# EAGLE design bp_usb (EAGLE 9.5.0)
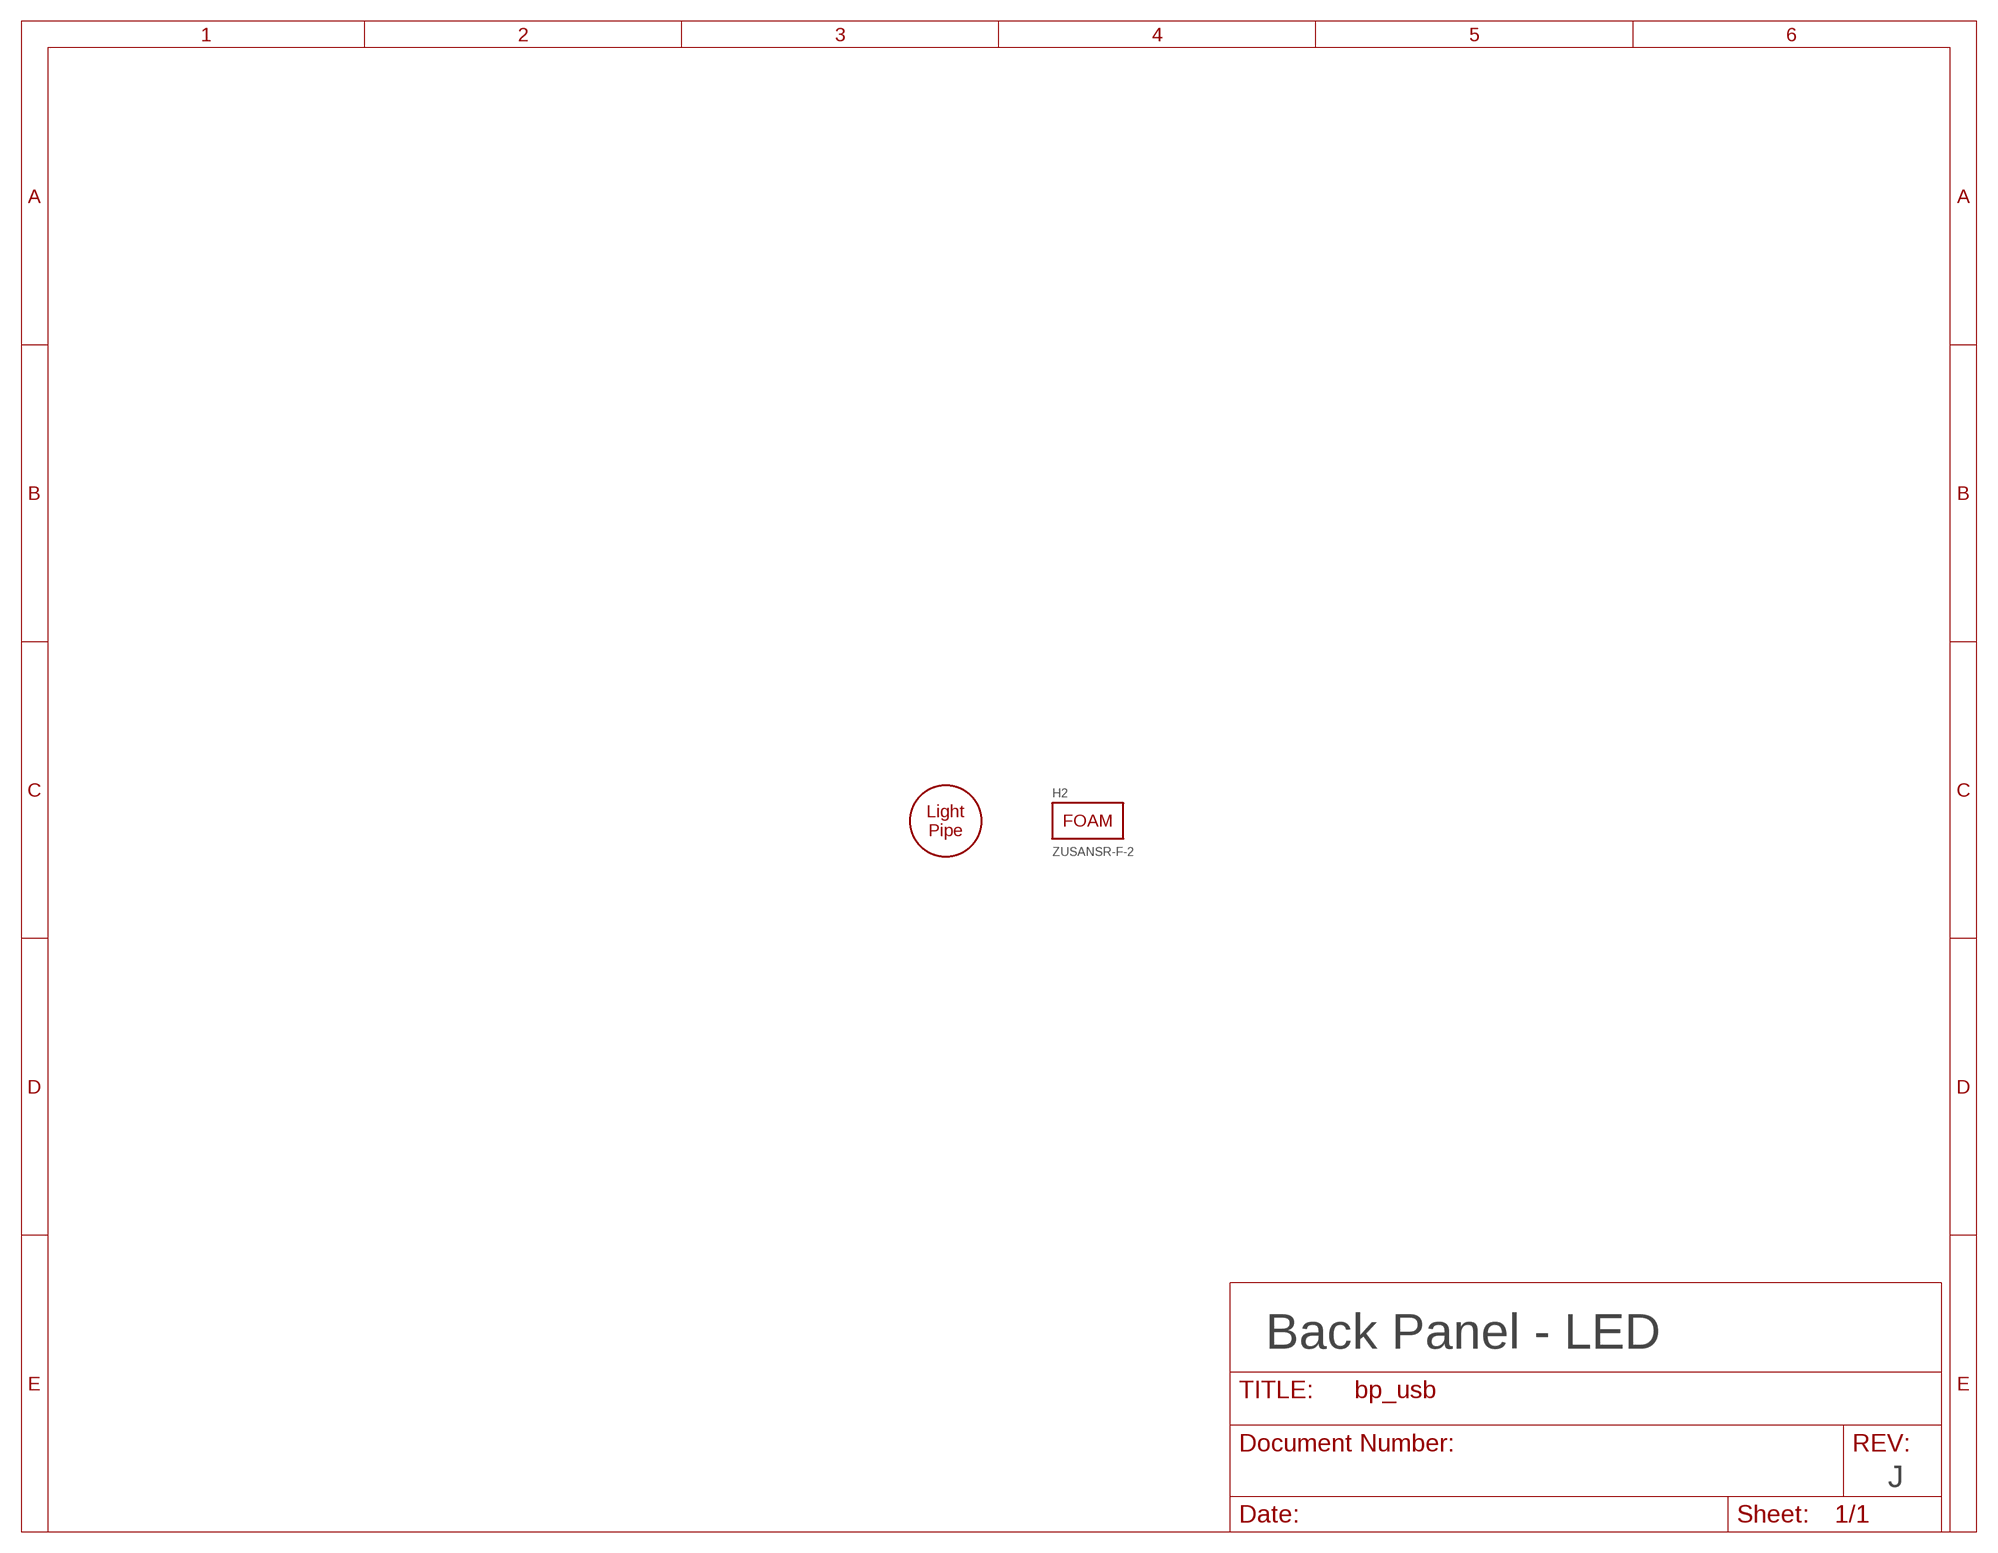
[diagram p0: schematic, sheet 1]

## Parts
H1  51513020125F  LIGHT_PIPE_PANEL_3MM  [LP_3MM]
H2  ZUSANSR-F-2  FOAM_0.5_0.25  [FOAM_0.5_0.25]

## Notes on the sheet
- Back Panel - LED
- J

## Library data of the parts
H1 = jetperch:LIGHT_PIPE; MPN: 51513020125F; POPULATE: 1
H2 = jetperch:FOAM; MPN: ZUSANSR-F-2; POPULATE: 1

## Net classes
1 USBD: width 1.016 mm, clearance 0.152 mm to class 0, clearance 0.508 mm

## Board
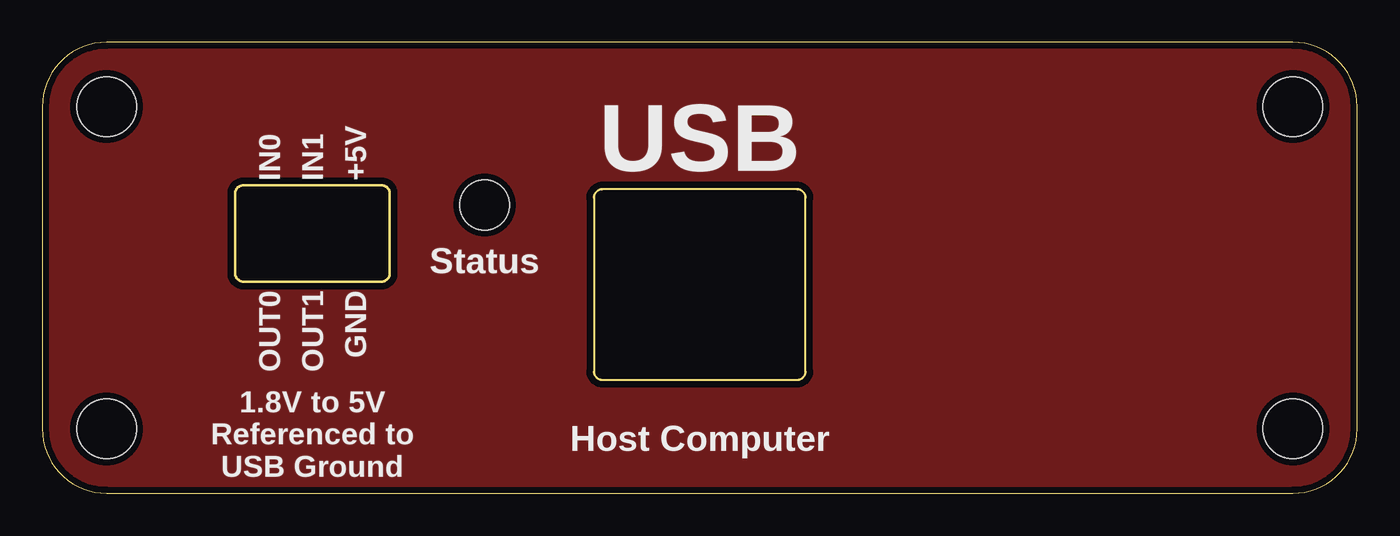
[diagram p1: board, top side]
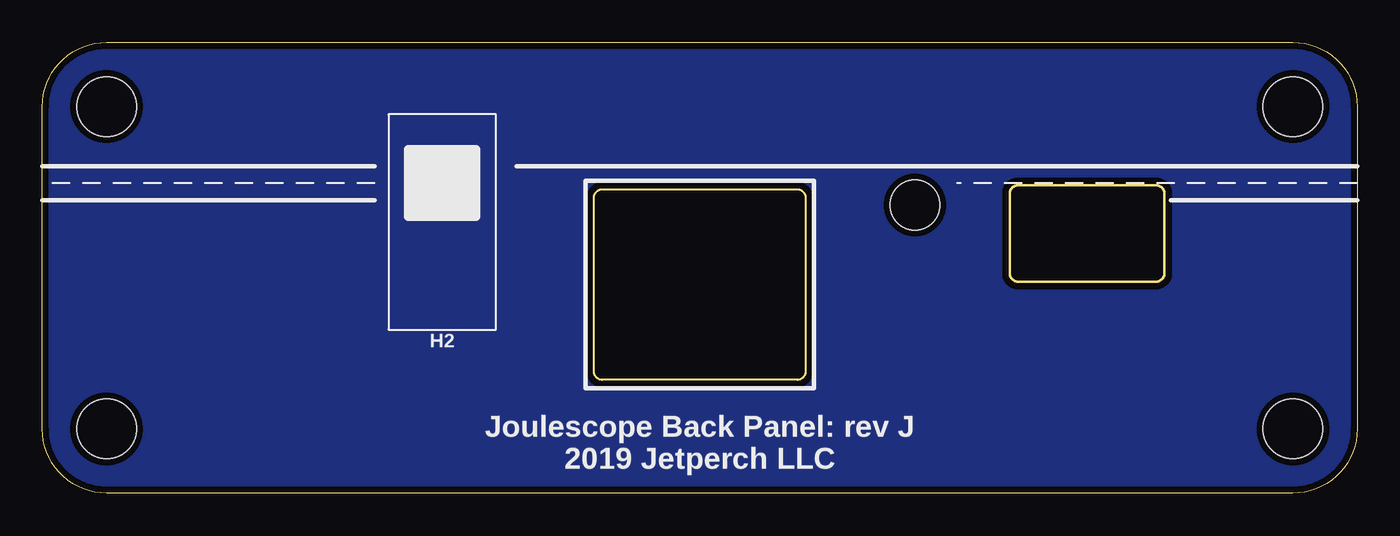
[diagram p2: board, bottom side, seen from below]

Size 77.6 x 26.6 mm. Coordinates in mm from the lower left corner, seen from the top.
Outline: 0,22.81 0,3.79 arc90 3.79,0 73.81,0 arc90 77.6,3.79 77.6,22.81 arc90 73.81,26.6 3.79,26.6 arc90 0,22.81
Outline: 33.05,6.69 44.55,6.69 arc90 45.05,7.19 45.05,17.43 arc90 44.55,17.93 33.05,17.93 arc90 32.55,17.43 32.55,7.19 arc90 33.05,6.69
Outline: 11.38,12.98 11.38,17.67 arc-90 11.88,18.17 20,18.17 arc-90 20.5,17.67 20.5,12.98 arc-90 20,12.48 11.88,12.48 arc-90 11.38,12.98
Copper layers (1*16): Top 0.035mm / dielectric 62mil / Bottom 0.035mm
Design rules "jetperch_2layer *": minimum track width 6mil, minimum drill 15mil, track to track 6mil, track to pad 6mil, pad to pad 6mil, via to via 6mil, smd to smd 0mil, copper to edge 15mil, drill to drill 15mil, minimum pad ring 6mil, minimum via ring 6mil, stop-mask expansion 2mil, vias tented up to drill 15mil, thermal gap 10mil
Holes 3.5 mm at 3.79,3.79 73.81,3.79 3.79,22.81 73.81,22.81
bKeepout: area 0,17.3 to 77.6,19.3; area 0,0 to 77.6,1.5; area 0,25.1 to 77.6,26.6; area 0,0 to 1.5,26.6; area 76.1,0 to 77.6,26.6

### Footprints (pad centres in the part's own frame; a part is rotated, then mirrored left to right if it is on the bottom)
LP_3MM = hole 2.921: 0,0

### Placement (x,y rotation side)
H1  26.1,17 0 top
H2  54,16 0 bottom

### Tracks (layer width: path | path; a pad name or v marks a point on that pad's centre or on a via)
EXT_NEG
  pour Top (isolate 0.254, rank 3, no thermals): 3.79,26.6 73.81,26.6 arc-90 77.6,22.81 77.6,3.79 arc-90 73.81,0 3.79,0 arc-90 0,3.79 0,22.81 arc-90
  pour Bottom (isolate 0.254, rank 2): 3.79,26.6 73.81,26.6 arc-90 77.6,22.81 77.6,3.79 arc-90 73.81,0 3.79,0 arc-90 0,3.79 0,22.81 arc-90
  cutout Top: 11.38,18.17 20.5,18.17 20.5,12.48 11.38,12.48
  cutout Bottom: 11.38,18.17 20.5,18.17 20.5,12.48 11.38,12.48
  cutout Top: 32.55,17.93 45,17.93 45,6.69 32.55,6.69
  cutout Bottom: 32.55,17.93 45,17.93 45,6.69 32.55,6.69

### Text on the board
_tsilk: USB | IN0 / IN1 / +5V | Status | OUT0 / OUT1 / GND | 1.8V to 5V / Referenced to / USB Ground | Host Computer
_bsilk: Joulescope Back Panel: rev J / 2019 Jetperch LLC
FabDoc1: All dimensions in millimeters / Place all markings on back (including pcb order number). / Add flammability rating marking on back, such as 94V-0. / The front-side surface is cosmetic - reject units with scratches and blemishes.